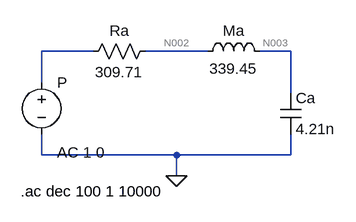
[diagram p0: schematic EA_Garrafa.asc]
EA_Garrafa.asc, the LTspice schematic file:
Version 4
SHEET 1 880 680
WIRE 32 64 -48 64
WIRE 208 64 112 64
WIRE 336 64 288 64
WIRE -48 112 -48 64
WIRE 336 128 336 64
WIRE -48 224 -48 192
WIRE 160 224 -48 224
WIRE 336 224 336 192
WIRE 336 224 160 224
WIRE 160 256 160 224
FLAG 160 256 0
SYMBOL voltage -48 96 R0
WINDOW 123 24 124 Left 2
WINDOW 39 0 0 Left 0
SYMATTR Value2 AC 1 0
SYMATTR InstName P
SYMATTR Value ""
SYMBOL res 128 48 R90
WINDOW 0 0 56 VBottom 2
WINDOW 3 32 56 VTop 2
SYMATTR InstName Ra
SYMATTR Value 309.71
SYMBOL ind 192 80 R270
WINDOW 0 32 56 VTop 2
WINDOW 3 5 56 VBottom 2
SYMATTR InstName Ma
SYMATTR Value 339.45
SYMBOL cap 320 128 R0
SYMATTR InstName Ca
SYMATTR Value 4.21n
TEXT -80 280 Left 2 !.ac dec 100 1 10000

The netlist it stands for:
* EA_Garrafa.asc
V§P N001 0 AC 1 0
Ra N002 N001 309.71
L§Ma N002 N003 339.45
Ca N003 0 4.21n
.ac dec 100 1 10000
.backanno
.end

* Results of the author's LTspice run, read from the files saved beside the schematic
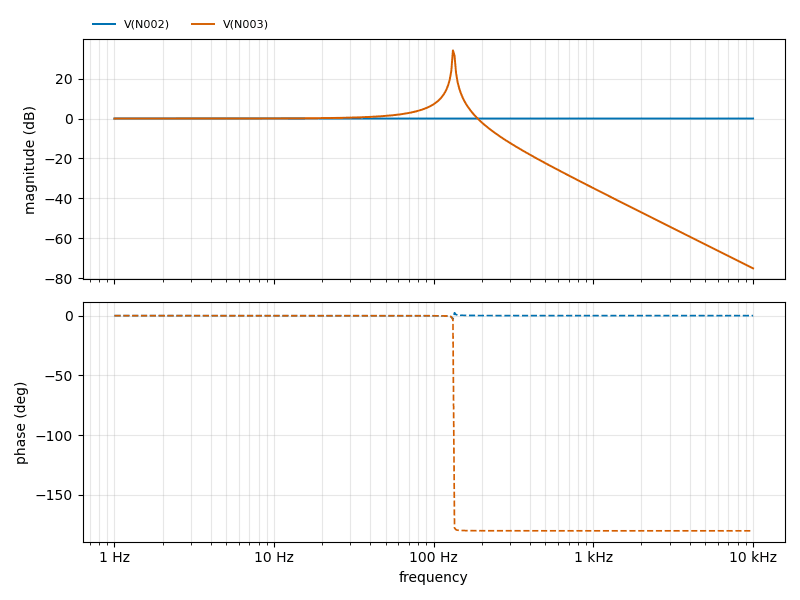
[diagram p1: AC Analysis of EA_Garrafa.asc, plotted from the saved traces]
* AC Analysis, 1 run:
*   V(N002): -0.00 dB at 1 Hz, -0.00 dB at 10 kHz, peak -0.00 dB at 1 Hz
*   V(N003): 0.00 dB at 1 Hz, -75.03 dB at 10 kHz, peak 34.16 dB at 131.8 Hz, 3 dB below the peak at 130.9 Hz and 135 Hz